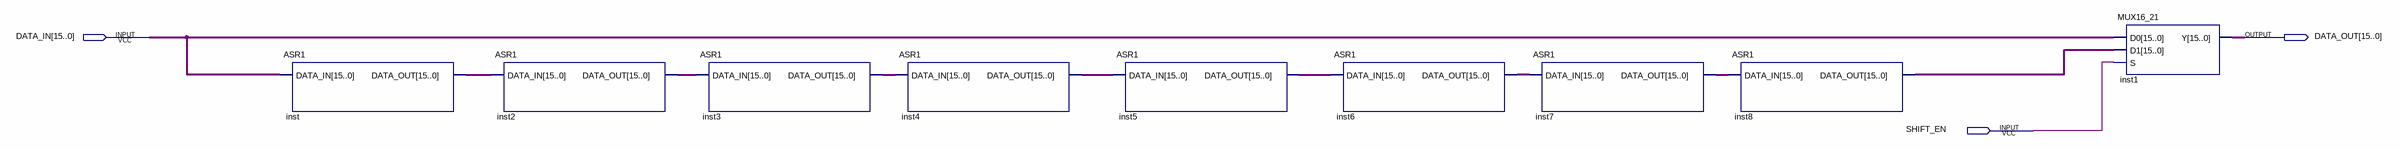
[diagram p0: schematic sheet]
// Quartus schematic SHIFTER_STAGE3.bdf as structural Verilog: 9 symbols, 3 pins
module SHIFTER_STAGE3 (
  input  [15:0] DATA_IN,
  input  SHIFT_EN,
  output [15:0] DATA_OUT
);

  wire [15:0] inst2_data_out, inst3_data_out, inst4_data_out, inst5_data_out, inst6_data_out, inst7_data_out,
       inst8_data_out, inst_data_out;

  ASR1 inst (.DATA_IN(DATA_IN), .DATA_OUT(inst_data_out));
  ASR1 inst2 (.DATA_IN(inst_data_out), .DATA_OUT(inst2_data_out));
  ASR1 inst3 (.DATA_IN(inst2_data_out), .DATA_OUT(inst3_data_out));
  ASR1 inst4 (.DATA_IN(inst3_data_out), .DATA_OUT(inst4_data_out));
  ASR1 inst5 (.DATA_IN(inst4_data_out), .DATA_OUT(inst5_data_out));
  ASR1 inst6 (.DATA_IN(inst5_data_out), .DATA_OUT(inst6_data_out));
  ASR1 inst7 (.DATA_IN(inst6_data_out), .DATA_OUT(inst7_data_out));
  ASR1 inst8 (.DATA_IN(inst7_data_out), .DATA_OUT(inst8_data_out));
  MUX16_21 inst1 (.D0(DATA_IN), .D1(inst8_data_out), .S(SHIFT_EN), .Y(DATA_OUT));
endmodule
